# Altium project otonom_iha.PrjPcb
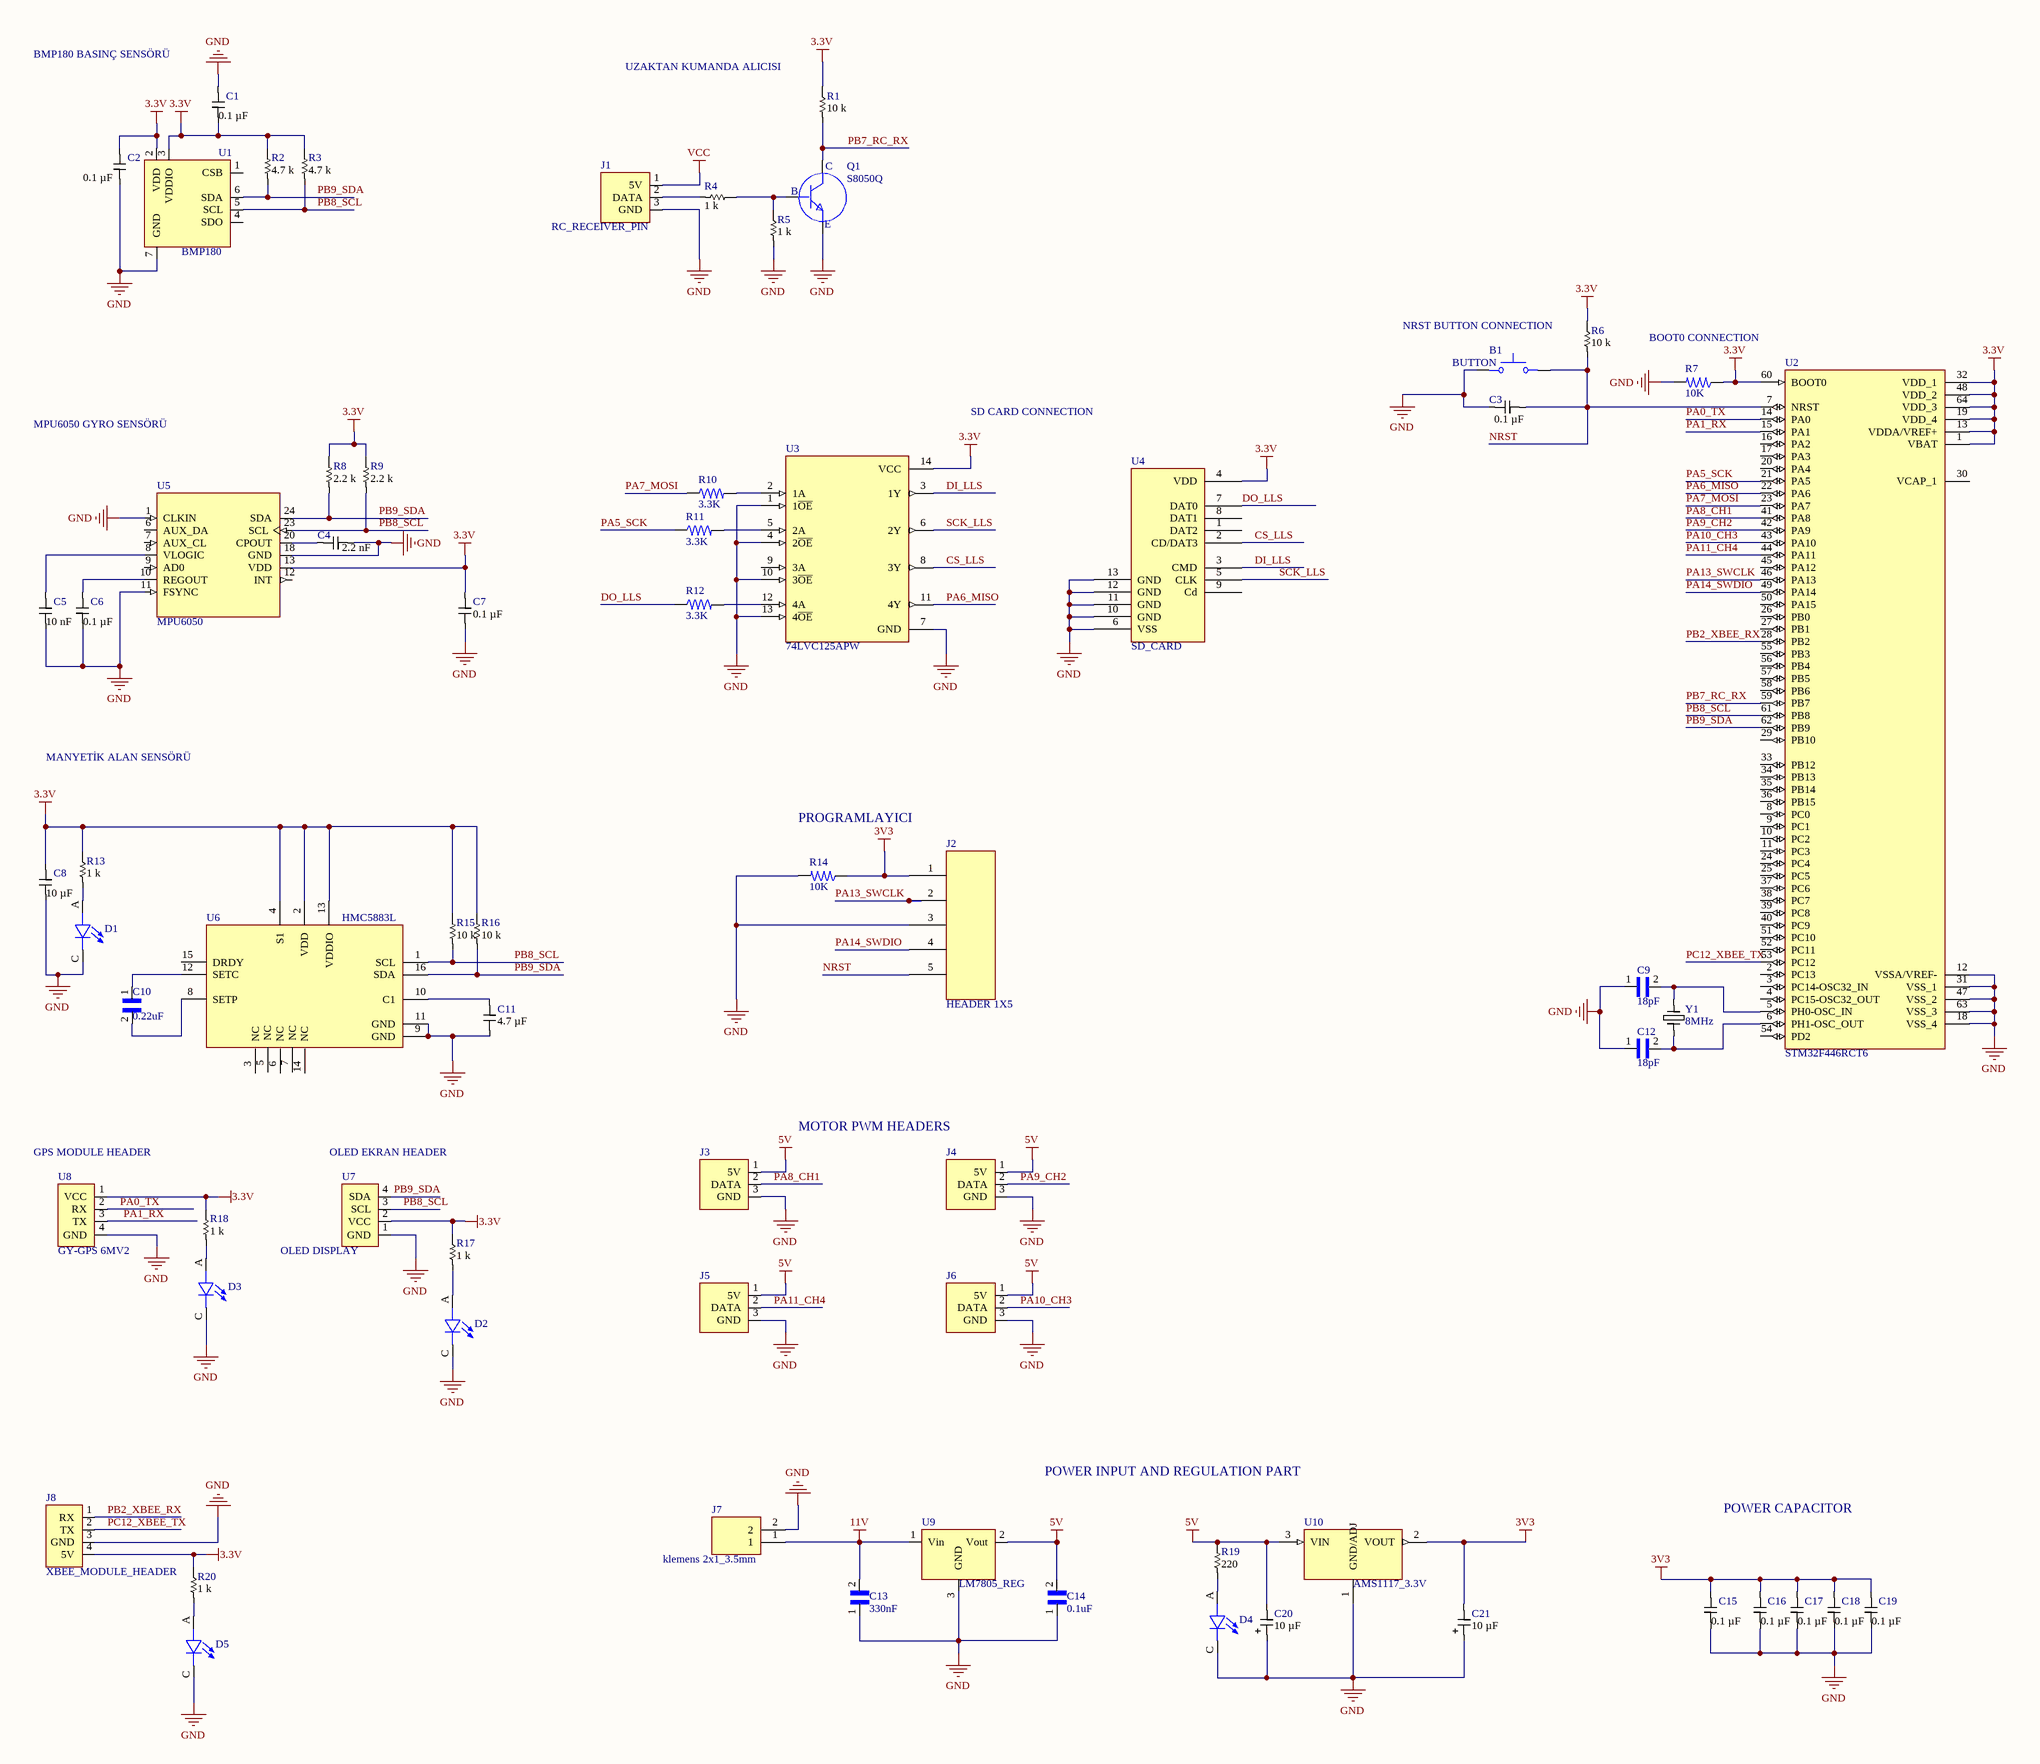
[diagram p0: Sheet1.SchDoc]
1 sheet, 67 parts. Net scope: global (net labels, ports and power ports of the same name join across sheets).
Board file: PCB1.PcbDoc

## Sheet Sheet1.SchDoc
size A2; SheetNumber: 1; SheetTotal: 1

### Parts
B1  BUTTON  [BUTTON]
C1  Capacitance: 0.1 µF  [SAMSUNG_CAP_0603_090]  (hidden comment: CL10B104KB8NNNC)
C2  Capacitance: 0.1 µF  [SAMSUNG_CAP_0603_090]  (hidden comment: CL10B104KB8NNNC)
C3  Capacitance: 0.1 µF  [SAMSUNG_CAP_0603_090]  (hidden comment: CL10B104KB8NNNC)
C4  Capacitance: 2.2 nF  [SAMSUNG_CAP_0603_090]  (hidden comment: CL10B222KB8NNNC)
C5  Capacitance: 10 nF  [SAMSUNG_CAP_0603_090]  (hidden comment: CL10B103KB8NNNL)
C6  Capacitance: 0.1 µF  [SAMSUNG_CAP_0603_090]  (hidden comment: CL10B104KB8NNNC)
C7  Capacitance: 0.1 µF  [SAMSUNG_CAP_0603_090]  (hidden comment: CL10B104KB8NNNC)
C8  Capacitance: 10 µF  [SAMSUNG_CAP_0805_140]  (hidden comment: CL21B106KPQNNNE)
C9  18pF  [18pF capacitor]
C10  0.22uF  [0.22uF CAPACITOR]
C11  Capacitance: 4.7 µF  [SAMSUNG_CAP_0805_095]  (hidden comment: CL21A475KACLRNC)
C12  18pF  [18pF capacitor]
C13  330nF  [1206CAPACITOR]
C14  0.1uF  [1206CAPACITOR]
C15  Capacitance: 0.1 µF  [SAMSUNG_CAP_0603_090]  (hidden comment: CL10B104KB8NNNC)
C16  Capacitance: 0.1 µF  [SAMSUNG_CAP_0603_090]  (hidden comment: CL10B104KB8NNNC)
C17  Capacitance: 0.1 µF  [SAMSUNG_CAP_0603_090]  (hidden comment: CL10B104KB8NNNC)
C18  Capacitance: 0.1 µF  [SAMSUNG_CAP_0603_090]  (hidden comment: CL10B104KB8NNNC)
C19  Capacitance: 0.1 µF  [SAMSUNG_CAP_0603_090]  (hidden comment: CL10B104KB8NNNC)
C20  Capacitance: 10 µF  [KEMET_CAP_TAN-B]  (hidden comment: T491B106M016AT)
C21  Capacitance: 10 µF  [KEMET_CAP_TAN-B]  (hidden comment: T491B106M016AT)
D1  MP-2016-1100-30-80  [LED_MP-2016-1100-30-80]  (value not drawn)
D2  MP-2016-1100-30-80  [LED_MP-2016-1100-30-80]  (value not drawn)
D3  MP-2016-1100-30-80  [LED_MP-2016-1100-30-80]  (value not drawn)
D4  MP-2016-1100-30-80  [LED_MP-2016-1100-30-80]  (value not drawn)
D5  MP-2016-1100-30-80  [LED_MP-2016-1100-30-80]  (value not drawn)
J1  RC_RECEIVER_PIN  [RC_RECEIVER_PIN]
J2  HEADER 1X5  [HEADER 1X5_2.54mm]
J3  MOTOR_PWM_HEADER  [MOTOR_PWM_HEADER]  (value not drawn)
J4  MOTOR_PWM_HEADER  [MOTOR_PWM_HEADER]  (value not drawn)
J5  MOTOR_PWM_HEADER  [MOTOR_PWM_HEADER]  (value not drawn)
J6  MOTOR_PWM_HEADER  [MOTOR_PWM_HEADER]  (value not drawn)
J7  klemens 2x1_3.5mm  [KLEMENS 2X1_3.5mm - duplicate]
J8  XBEE_MODULE_HEADER  [XBEE_MODULE_HEADER]
Q1  S8050Q  [S8050Q]
R1  Resistance: 10 k  [ROYALOHM_RES_0603]  (hidden comment: 0603SAJ0103T5E)
R2  Resistance: 4.7 k  [ROYALOHM_RES_0603]  (hidden comment: 0603SAJ0472TDE)
R3  Resistance: 4.7 k  [ROYALOHM_RES_0603]  (hidden comment: 0603SAJ0472TDE)
R4  Resistance: 1 k  [ROYALOHM_RES_0603]  (hidden comment: 0603SAJ0102T5E)
R5  Resistance: 1 k  [ROYALOHM_RES_0603]  (hidden comment: 0603SAJ0102T5E)
R6  Resistance: 10 k  [ROYALOHM_RES_0603]  (hidden comment: 0603SAJ0103T5E)
R7  10K  [RES]
R8  Resistance: 2.2 k  [ROYALOHM_RES_0805]  (hidden comment: 0805S8J0222T5E)
R9  Resistance: 2.2 k  [ROYALOHM_RES_0805]  (hidden comment: 0805S8J0222T5E)
R10  3.3K  [0805 cap RES]
R11  3.3K  [0805 cap RES]
R12  3.3K  [0805 cap RES]
R13  Resistance: 1 k  [ROYALOHM_RES_0603]  (hidden comment: 0603SAJ0102T5E)
R14  10K  [RES]
R15  Resistance: 10 k  [ROYALOHM_RES_0603]  (hidden comment: 0603SAJ0103T5E)
R16  Resistance: 10 k  [ROYALOHM_RES_0603]  (hidden comment: 0603SAJ0103T5E)
R17  Resistance: 1 k  [ROYALOHM_RES_0603]  (hidden comment: 0603SAJ0102T5E)
R18  Resistance: 1 k  [ROYALOHM_RES_0603]  (hidden comment: 0603SAJ0102T5E)
R19  Resistance: 220  [ROYALOHM_RES_0603]  (hidden comment: 0603SAJ0221T5E)
R20  Resistance: 1 k  [ROYALOHM_RES_0603]  (hidden comment: 0603SAJ0102T5E)
U1  BMP180  [BMP180]
U2  STM32F446RCT6  [STM32F446RCT6]
U3  74LVC125APW  [74LVC125APW]
U4  SD_CARD  [SD_CARD]
U5  MPU6050  [MPU6050]
U6  HMC5883L  [HMC5883L]
U7  OLED DISPLAY  [OLED DISPLAY]
U8  GY-GPS 6MV2  [GY-GPS 6MV2]
U9  LM7805_REG  [DPAK228P968X230-3N]
U10  AMS1117_3.3V  [AMS1117_3.3V]
Y1  8MHz  [ABM3-8.000MHZ-D2Y-T]

### Nets
3.3V: C1.2 C2.1 C7.2 C8.2 J8.4(5V) R1.2 R2.2 R3.2 R6.2 R7.1 R8.2 R9.2 R13.2 R15.2 R16.2 R17.2 R18.2 R20.2 U1.2(VDD) U1.3(VDDIO) U2.1(VBAT) U2.13(VDDA/VREF+) U2.19(VDD_4) U2.32(VDD_1) U2.48(VDD_2) U2.60(BOOT0) U2.64(VDD_3) U3.14(VCC) U4.4(VDD) U5.13(VDD) U6.2(VDD) U6.4(S1) U6.13(VDDIO) U7.2(VCC) U8.1(VCC)
3V3: C15.1 C16.1 C17.1 C18.1 C19.1 C21.2 J2.1 R14.1 U10.2(VOUT)
5V: C14.2 C20.2 J3.1(5V) J4.1(5V) J5.1(5V) J6.1(5V) R19.2 U9.2(Vout) U10.3(VIN)
11V: C13.2 J7.1 U9.1(Vin)
GND: B1.1 C1.1 C2.2 C3.1 C4.2 C5.1 C6.2 C7.1 C8.1 C9.1 C11.1 C12.1 C13.1 C14.1 C15.2 C16.2 C17.2 C18.2 C19.2 C20.1 C21.1 D1.C D2.C D3.C D4.C D5.C J1.3(GND) J2.3 J3.3(GND) J4.3(GND) J5.3(GND) J6.3(GND) J7.2 J8.3(GND) Q1.2(E) R5.1 R7.2 R14.2 U1.7(GND) U2.12(VSSA/VREF-) U2.18(VSS_4) U2.31(VSS_1) U2.47(VSS_2) U2.63(VSS_3) U3.1(1~{OE}) U3.4(2~{OE}) U3.7(GND) U3.10(3~{OE}) U3.13(4~{OE}) U4.6(VSS) U4.10(GND) U4.11(GND) U4.12(GND) U4.13(GND) U5.1(CLKIN) U5.11(FSYNC) U5.18(GND) U6.9(GND) U6.11(GND) U7.1(GND) U8.4(GND) U9.3(GND) U10.1(GND/ADJ)
VCC: J1.1(5V)
CS_LLS: U3.8(3Y) U4.2(CD/DAT3)
DI_LLS: U3.3(1Y) U4.3(CMD)
DO_LLS: R12.1 U4.7(DAT0)
NRST: B1.3 C3.2 J2.5 R6.1 U2.7(NRST)
PA0_TX: U2.14(PA0) U8.2(RX)
PA1_RX: U2.15(PA1) U8.3(TX)
PA5_SCK: R11.1 U2.21(PA5)
PA6_MISO: U2.22(PA6) U3.11(4Y)
PA7_MOSI: R10.1 U2.23(PA7)
PA8_CH1: J3.2(DATA) U2.41(PA8)
PA9_CH2: J4.2(DATA) U2.42(PA9)
PA10_CH3: J6.2(DATA) U2.43(PA10)
PA11_CH4: J5.2(DATA) U2.44(PA11)
PA13_SWCLK: J2.2 U2.46(PA13)
PA14_SWDIO: J2.4 U2.49(PA14)
PB2_XBEE_RX: J8.1(RX) U2.28(PB2)
PB7_RC_RX: Q1.3(C) R1.1 U2.59(PB7)
PB8_SCL: R3.1 R9.1 R15.1 U1.5(SCL) U2.61(PB8) U5.23(SCL) U6.1(SCL) U7.3(SCL)
PB9_SDA: R2.1 R8.1 R16.1 U1.6(SDA) U2.62(PB9) U5.24(SDA) U6.16(SDA) U7.4(SDA)
PC12_XBEE_TX: J8.2(TX) U2.53(PC12)
SCK_LLS: U3.6(2Y) U4.5(CLK)
NetC4_1: C4.1 U5.20(CPOUT)
NetC5_2: C5.2 U5.8(VLOGIC)
NetC6_1: C6.1 U5.10(REGOUT)
NetC9_2: C9.2 U2.5(PH0-OSC_IN) Y1.2
NetC10_1: C10.1 U6.12(SETC)
NetC10_2: C10.2 U6.8(SETP)
NetC11_2: C11.2 U6.10(C1)
NetC12_2: C12.2 U2.6(PH1-OSC_OUT) Y1.1
NetD1_A: D1.A R13.1
NetD2_A: D2.A R17.1
NetD3_A: D3.A R18.1
NetD4_A: D4.A R19.1
NetD5_A: D5.A R20.1
NetJ1_2: J1.2(DATA) R4.1
NetQ1_1: Q1.1(B) R4.2 R5.2
NetR10_2: R10.2 U3.2(1A)
NetR11_2: R11.2 U3.5(2A)
NetR12_2: R12.2 U3.12(4A)

Not connected (* = marked no-connect by the designer): U1 1(CSB) 4(SDO); U2 2(PC13) 3(PC14-OSC32_IN) 4(PC15-OSC32_OUT) 8(PC0) 9(PC1) 10(PC2) 11(PC3) 16(PA2) 17(PA3) 20(PA4) 24(PC4) 25(PC5) 26(PB0) 27(PB1) 29(PB10) 30(VCAP_1) 33(PB12) 34(PB13) 35(PB14) 36(PB15) 37(PC6) 38(PC7) 39(PC8) 40(PC9) 45(PA12) 50(PA15) 51(PC10) 52(PC11) 54(PD2) 55(PB3) 56(PB4) 57(PB5) 58(PB6); U3 9(3A); U4 1(DAT2) 8(DAT1) 9(Cd); U5 6(AUX_DA) 7(AUX_CL) 9(AD0) 12(INT); U6 3(NC) 5(NC) 6(NC) 7(NC) 14(NC) 15(DRDY)

### Notes on the sheet
- BMP180 BASINÇ SENSÖRÜ
- UZAKTAN KUMANDA ALICISI
- (near B1) NRST BUTTON CONNECTION
- (near R7) BOOT0 CONNECTION
- MPU6050 GYRO SENSÖRÜ
- SD CARD CONNECTION
- MANYETİK ALAN SENSÖRÜ
- PROGRAMLAYICI
- (near U8) GPS MODULE HEADER
- (near U7) OLED EKRAN HEADER
- MOTOR PWM HEADERS
- POWER INPUT AND REGULATION PART
- POWER CAPACITOR

### Library data of the parts
C1-C3 C6 C7 C15-C19 = CL10B104KB8NNNC: CAP CER 0.1UF 50V X7R 0603; Supplier 1: Digi-Key; Supplier 2: Mouser; Supplier 3: Arrow Electronics; Supplier Part Number 1: 1276-1000-6-ND; Supplier Part Number 2: 187-CL10B104KB8NNNC; Supplier Part Number 3: CL10B104KB8NNNC
C4 = CL10B222KB8NNNC: CAP CER 2200PF 50V X7R 0603; Supplier 1: Digi-Key; Supplier 2: Farnell; Supplier 3: Mouser; Supplier 4: Arrow Electronics; Supplier Part Number 1: 1276-1110-1-ND; Supplier Part Number 2: 3013424; Supplier Part Number 3: 187-CL10B222KB8NNNC; Supplier Part Number 4: CL10B222KB8NNNC
C5 = CL10B103KB8NNNL: CAP CER 10000PF 50V X7R 0603; Supplier 1: Mouser; Supplier Part Number 1: 187-CL10B103KB8NNNL
C8 = CL21B106KPQNNNE: CAP CER 10UF 10V X7R 0805; Supplier 1: Digi-Key; Supplier 2: Farnell; Supplier 3: Mouser; Supplier Part Number 1: 1276-1764-6-ND; Supplier Part Number 2: 3013487; Supplier Part Number 3: 187-CL21B106KPQNNNE
C9 C12 = capacitor 18pF
C10 = 0.22uF CAPACITOR
C11 = CL21A475KACLRNC: CAP CER 4.7UF 25V X5R 0805; Supplier 1: Digi-Key; Supplier 2: Mouser; Supplier 3: Arrow Electronics; Supplier Part Number 1: 1276-2415-1-ND; Supplier Part Number 2: 187-CL21A475KACLRNC; Supplier Part Number 3: CL21A475KACLRNC
C13 C14 = 1206CAPACITOR
C20 C21 = T491B106M016AT: CAP TANT 10UF 20% 16V 1411; Supplier 1: Digi-Key; Supplier 2: Farnell; Supplier 3: Mouser; Supplier Part Number 1: 399-3708-1-ND; Supplier Part Number 2: 2462772; Supplier Part Number 3: 80-T491B106M016
D1-D5 = MP-2016-1100-30-80: LED Midpower Lighting series White, warm 3000K, 80 CRI, 27lm 3V 120mA 110Â°; MF: Luminus Devices; Purchase-URL: https://pricing.snapeda.com/search/part/MP-2016-1100-30-80/?ref=eda; Price: None; SnapEDA_Link: https://www.snapeda.com/parts/MP-2016-1100-30-80/Luminus+Devices+Inc./view-part/?ref=snap; MP: MP-2016-1100-30-80; Value: *; Availability: In Stock; Check_prices: https://www.snapeda.com/parts/MP-2016-1100-30-80/Luminus+Devices+Inc./view-part/?ref=eda; Package: None
Q1 = S8050Q: BJT TRANSİSTOR 25V 0.5mA
R1 R6 R15 R16 = 0603SAJ0103T5E: RES SMD 10K OHM 5% 1/10W 0603
R2 R3 = 0603SAJ0472TDE: RES SMD 4.7K OHM 5% 1/10W 0603
R4 R5 R13 R17 R18 R20 = 0603SAJ0102T5E: RES SMD 1K OHM 5% 1/10W 0603
R7 R14 = RES
R8 R9 = 0805S8J0222T5E: RES SMD 2.2K OHM 5% 1/8W 0805
R10-R12 = 0805 cap RES: RES 0.33 OHM 1% 1/4W 0805              0805 cap RES
R19 = 0603SAJ0221T5E: RES SMD 220R OHM 5% 1/10W 0603
U1 = BMP180: PRESSURE SENSOR
Y1 = ABM3-8.000MHZ-D2Y-T